# EAGLE design C128_Keyb_Test (EAGLE 9.5.2)
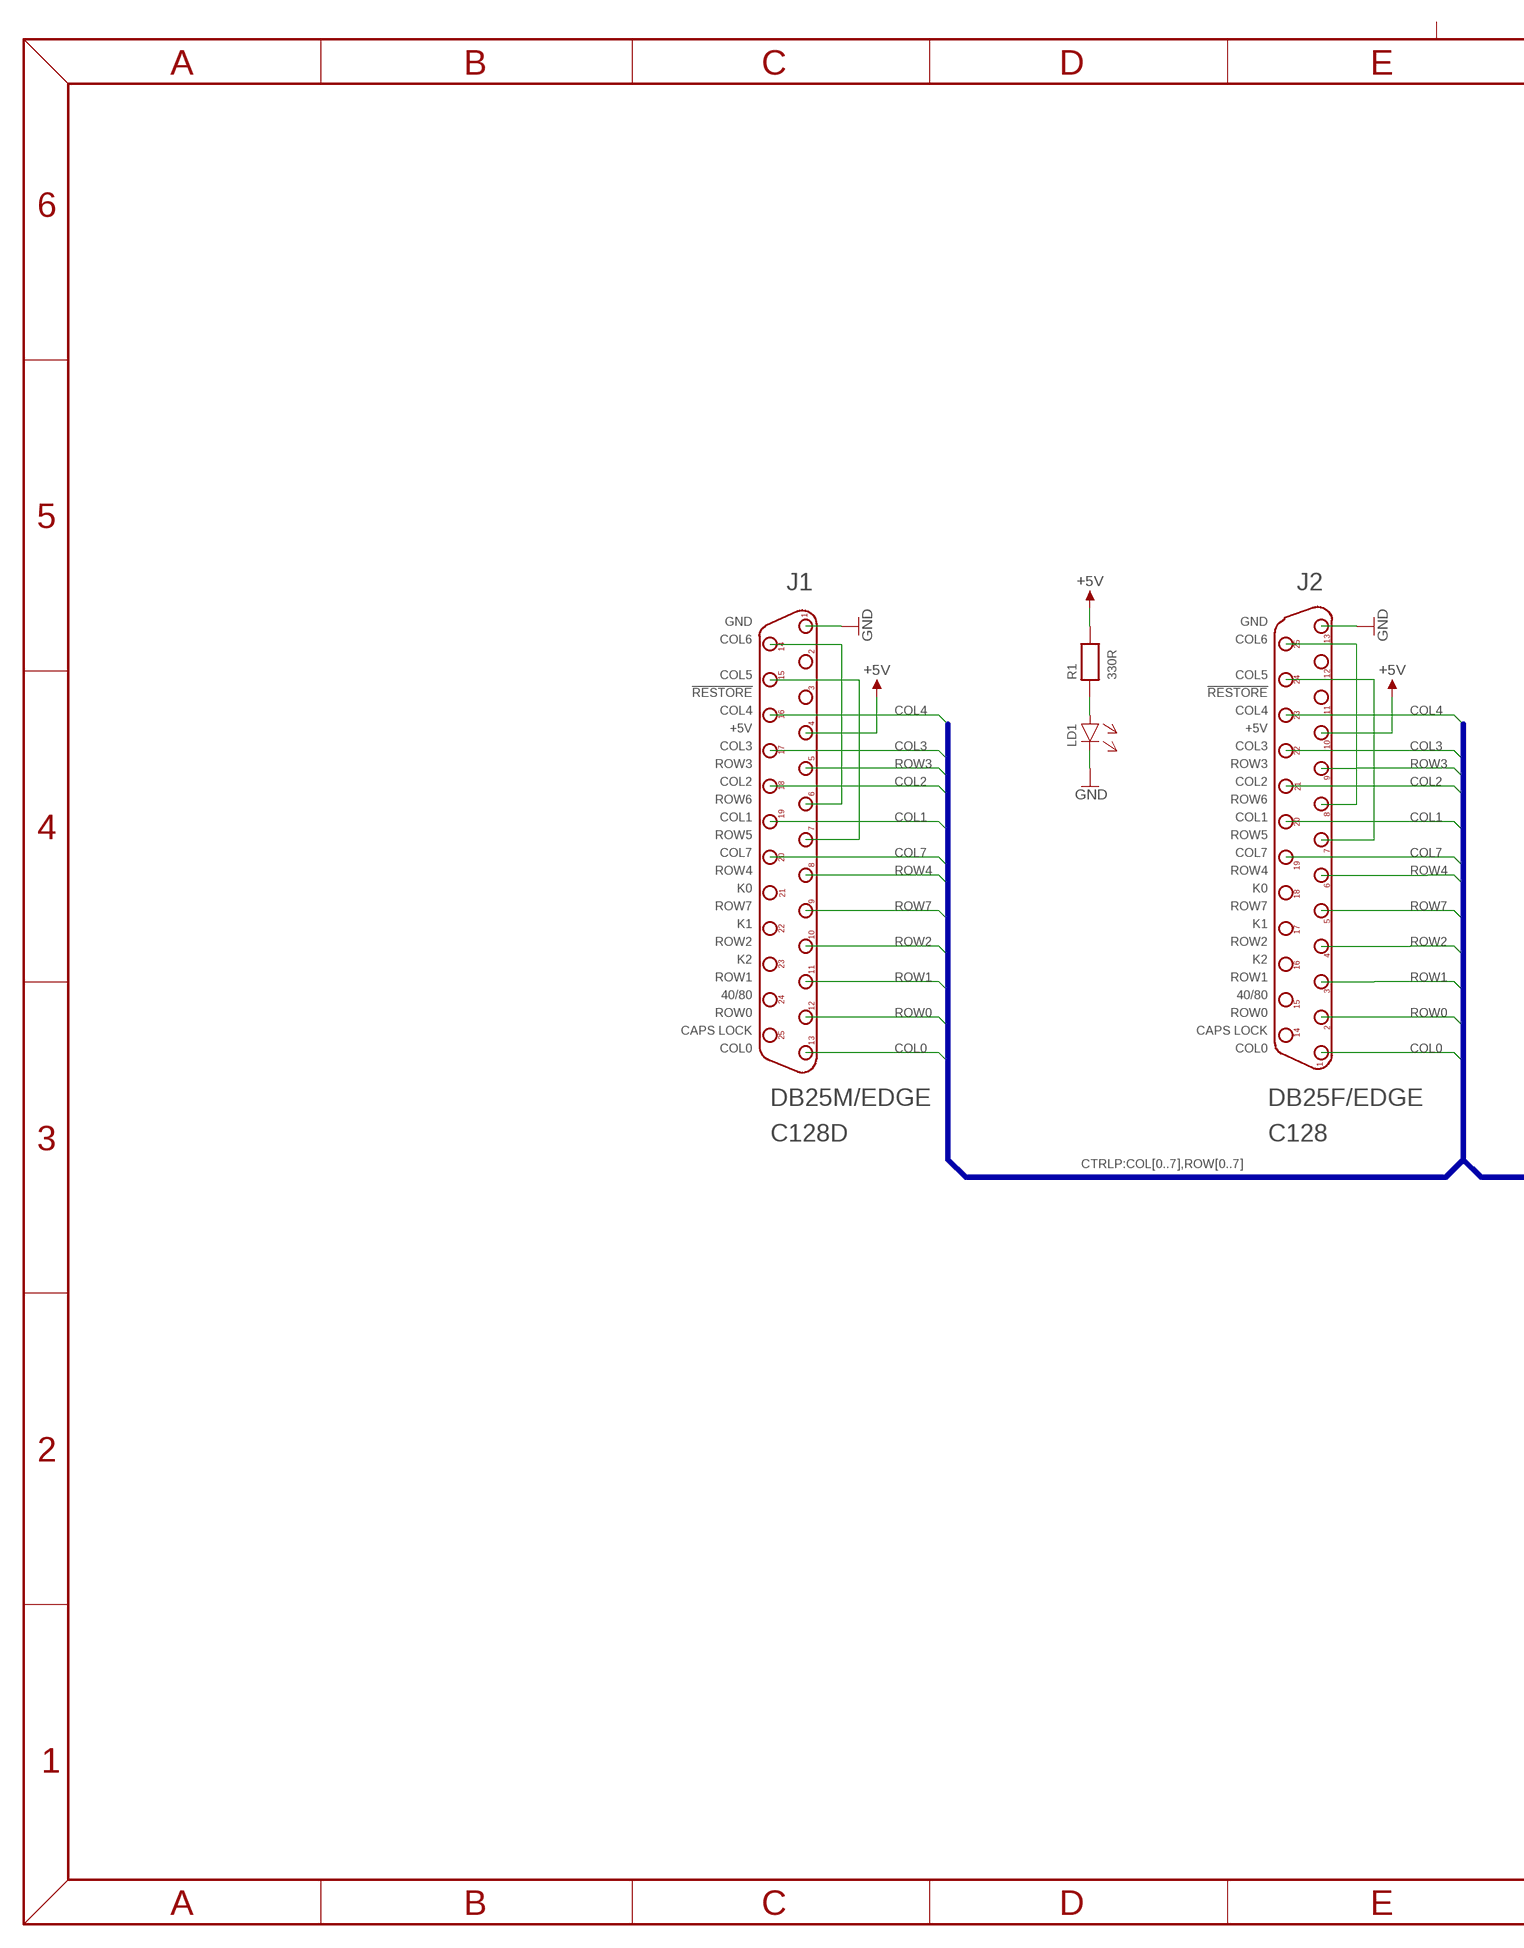
[diagram p0: schematic, sheet 1, part 1 of 2]
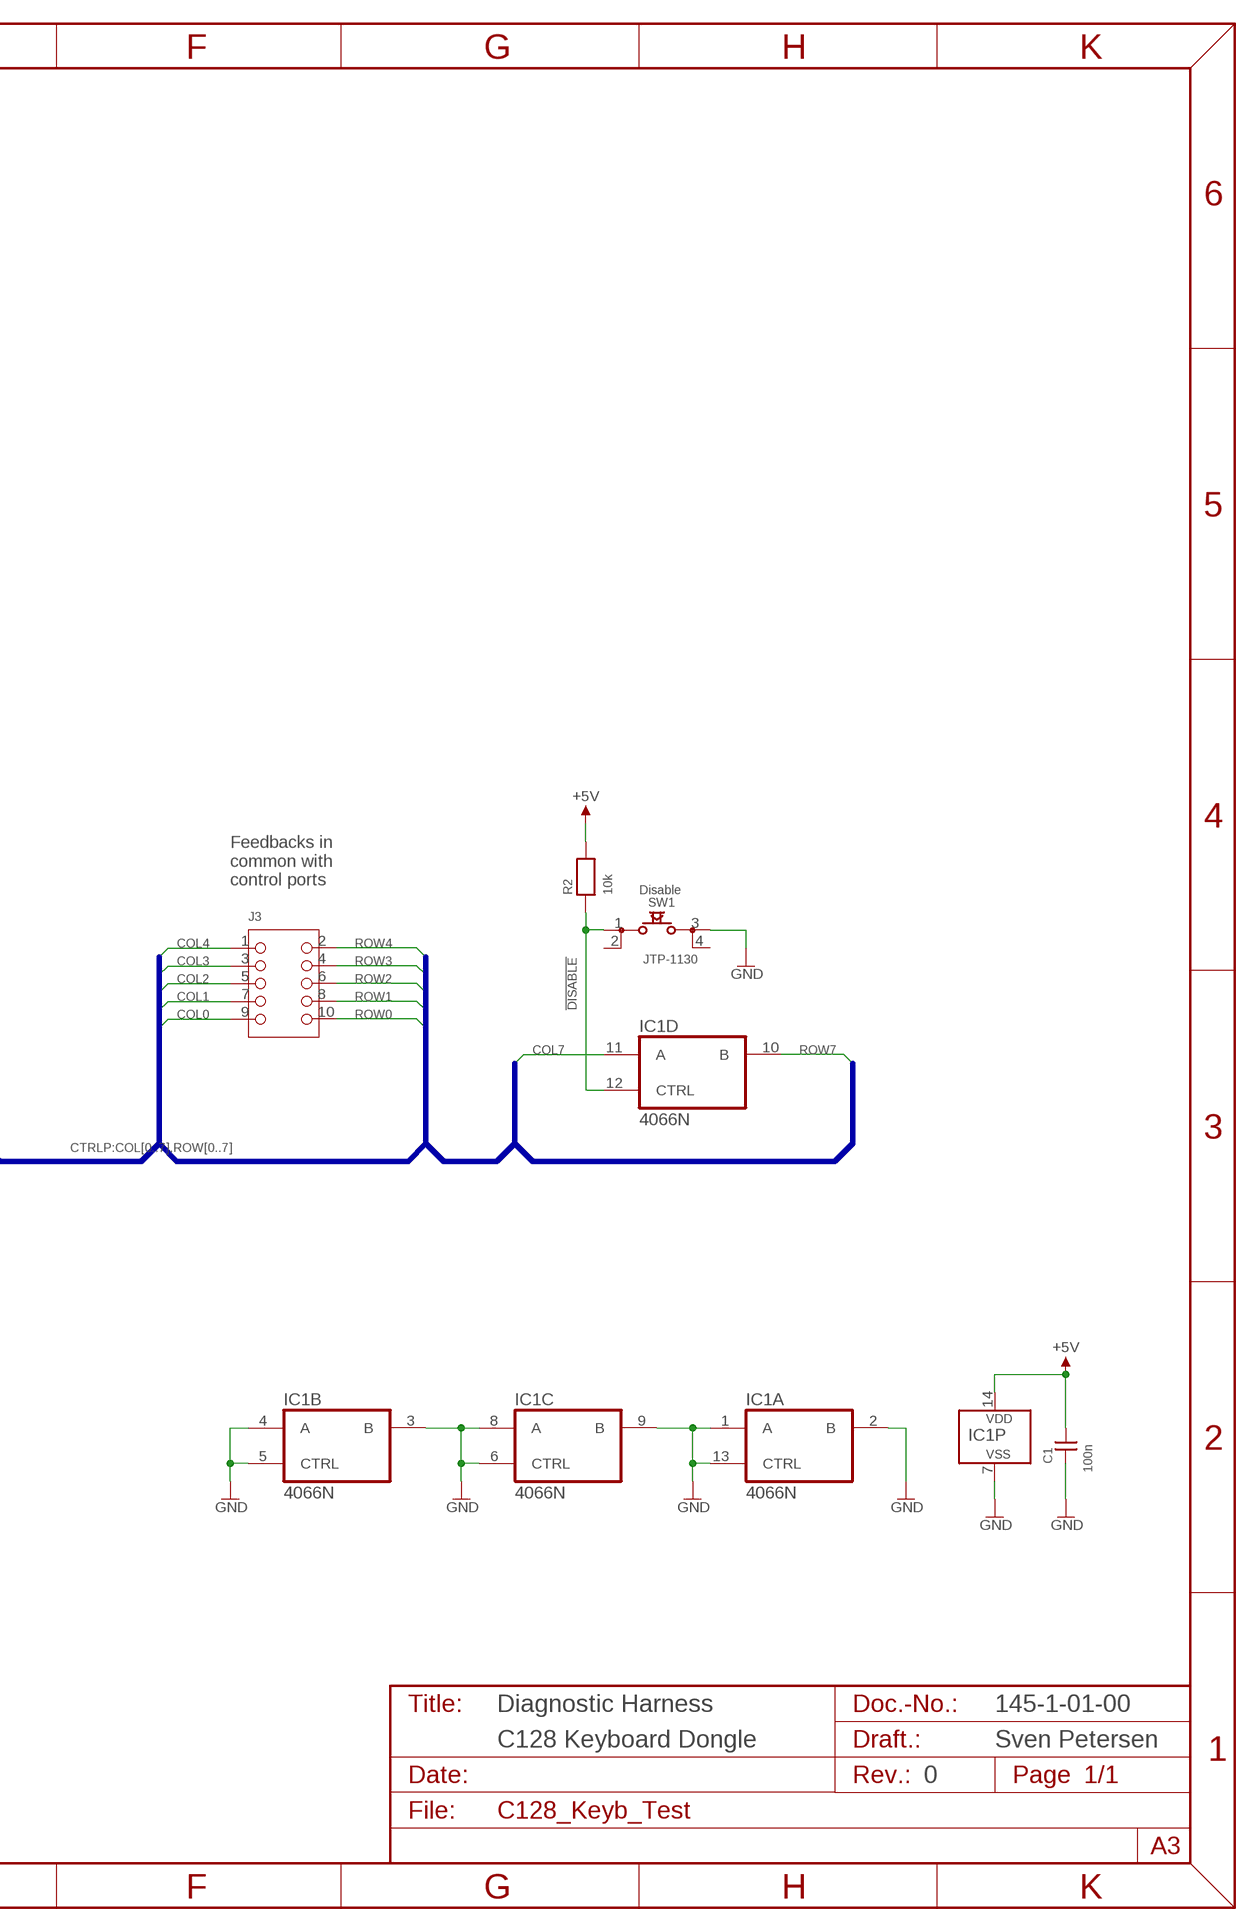
[diagram p1: schematic, sheet 1, part 2 of 2]

## Parts
C1  100n  CAP01  [C-2,5]
IC1  4066N  [DIL14]
J1  DB25M/EDGE  [DB25M-EDGE]
J2  DB25F/EDGE  [DB25F-EDGE]
J3  2X05WV  [2X05WV]
LD1  3MM  [3MM]
R1  330R  RES04  [R-10]
R2  10k  RES04  [R-10]
SW1  JTP-1130  [JTP-1130]

## Nets
!DISABLE: IC1.12(D:CTRL) R2.1 SW1.1
+5V: C1.2 IC1.14(P:VDD) J1.4 J2.10 R1.2 R2.2
COL0: J1.13 J2.1 J3.9
COL1: J1.19 J2.20 J3.7
COL2: J1.18 J2.21 J3.5
COL3: J1.17 J2.22 J3.3
COL4: J1.16 J2.23 J3.1
COL7: IC1.11(D:A) J1.20 J2.19
GND: C1.1 IC1.1(A:A) IC1.2(A:B) IC1.3(B:B) IC1.4(B:A) IC1.5(B:CTRL) IC1.6(C:CTRL) IC1.7(P:VSS) IC1.8(C:A) IC1.9(C:B) IC1.13(A:CTRL) J1.1 J2.13 LD1.C(K) SW1.3
N$1: J1.6 J1.14
N$2: J1.7 J1.15
N$3: LD1.A R1.1
N$14: J2.7 J2.24
N$15: J2.8 J2.25
ROW0: J1.12 J2.2 J3.10
ROW1: J1.11 J2.3 J3.8
ROW2: J1.10 J2.4 J3.6
ROW3: J1.5 J2.9 J3.4
ROW4: J1.8 J2.6 J3.2
ROW7: IC1.10(D:B) J1.9 J2.5
Unconnected: J1.2 J1.3 J1.21 J1.22 J1.23 J1.24 J1.25 J2.11 J2.12 J2.14 J2.15 J2.16 J2.17 J2.18 SW1.2 SW1.4

## Buses
CTRLP:COL[0..7],ROW[0..7]

## Notes on the sheet
- GND | GND
- COL6 | COL6
- COL5 | COL5
- !RESTORE | !RESTORE
- COL4 | COL4
- +5V | +5V
- COL3 | COL3
- ROW3 | ROW3
- COL2 | COL2
- ROW6 | ROW6
- COL1 | COL1
- ROW5 | ROW5
- COL7 | COL7
- ROW4 | ROW4
- K0 | K0
- Feedbacks in
  common with
  control ports
- ROW7 | ROW7 | Disable
- K1 | K1
- ROW2 | ROW2
- K2 | K2
- ROW1 | ROW1
- 40/80 | 40/80
- ROW0 | ROW0
- CAPS LOCK | CAPS LOCK
- COL0 | COL0
- C128D | C128
- Diagnostic Harness | 145-1-01-00
- C128 Keyboard Dongle | Sven Petersen
- 0

## Library data of the parts
C1 = DISCRETE:CAP01
IC1 = 40xx:4066: Quad bilateral ANALOG SWITCH
J1 = Connect:DB25M/EDGE
J2 = Connect:DB25F/EDGE
J3 = PINHEAD:2X05WV
LD1 = LED:3MM
R1 R2 = DISCRETE:RES04
SW1 = Namae_Electronics:JTP-1130

## Board
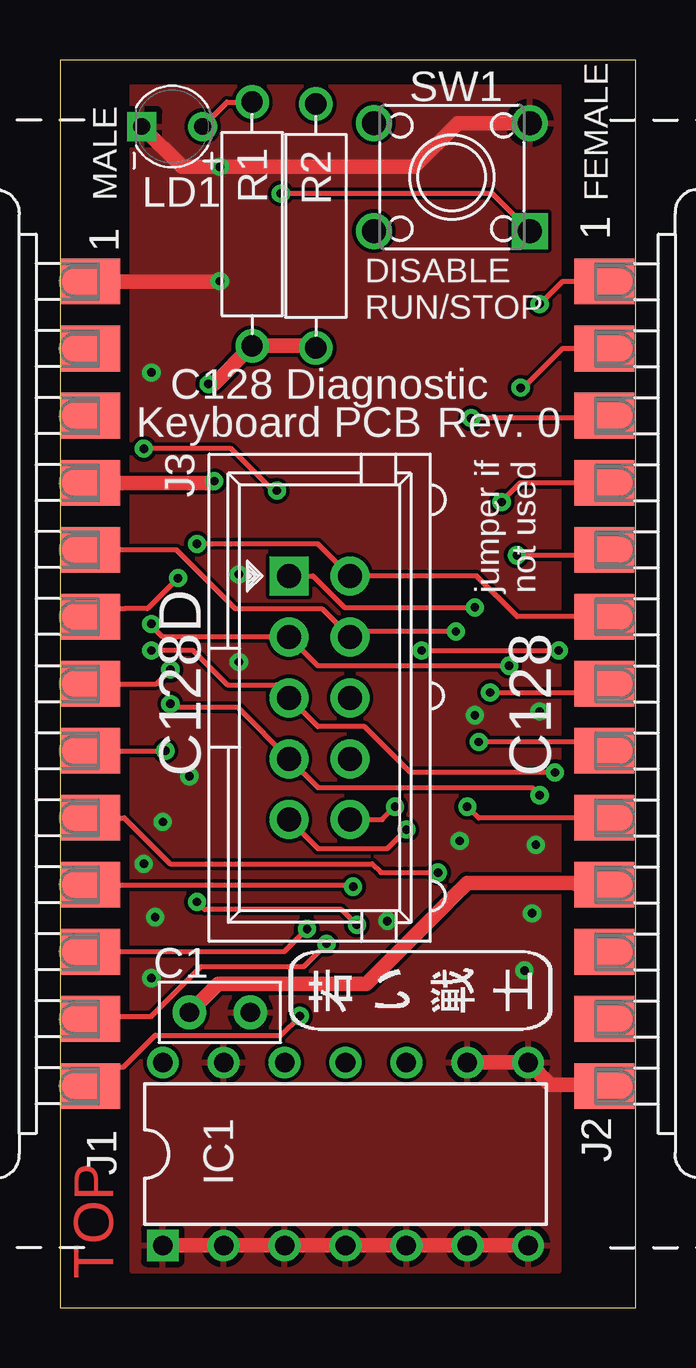
[diagram p2: board, top side]
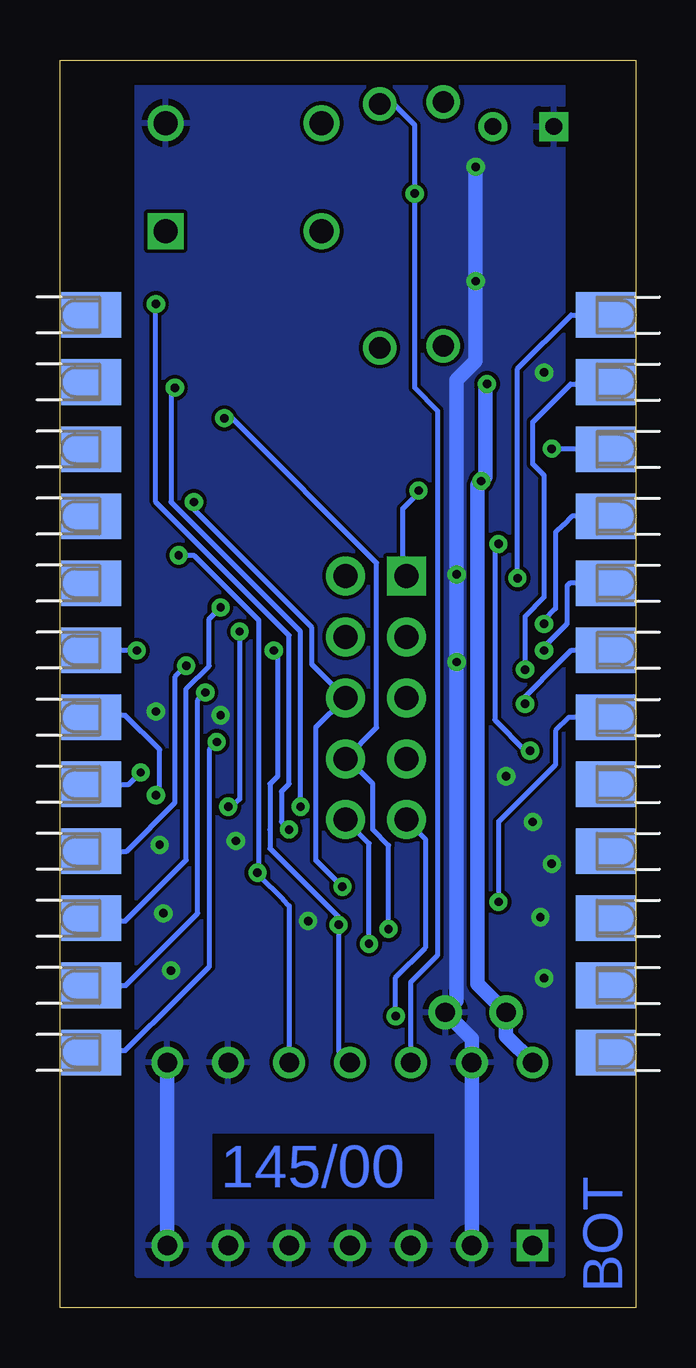
[diagram p3: board, bottom side, seen from below]

Size 24 x 52 mm. Coordinates in mm from the lower left corner, seen from the top.
Outline: 0,0 24,0 24,52 0,52 0,0
Copper layers (1*16): Top 0.035mm / dielectric 1.5mm / Bottom 0.035mm
Design rules "default *": minimum track width 6mil, minimum drill 0.35mm, track to track 6mil, track to pad 6mil, pad to pad 6mil, via to via 6mil, smd to smd 6mil, copper to edge 40mil, drill to drill 6mil, minimum pad ring 10mil, minimum via ring 8mil, stop-mask expansion 4mil, vias tented up to drill 25mil, thermal gap 10mil
bRestrict: 4 lines

### Footprints (pad centres in the part's own frame; a part is rotated, then mirrored left to right if it is on the bottom)
C-2,5 = drill 0.8 pad 1.397: 1 -1.27,0; 2 1.27,0
DIL14 = drill 0.813 square: 1 -7.62,-3.81 | drill 0.813: 2 -5.08,-3.81; 3 -2.54,-3.81; 4 0,-3.81; 5 2.54,-3.81; 6 5.08,-3.81; 7 7.62,-3.81; 8 7.62,3.81; 9 5.08,3.81; 10 2.54,3.81; 11 0,3.81; 12 -2.54,3.81; 13 -5.08,3.81; 14 -7.62,3.81
DB25M-EDGE = smd 1.9 x 2.5: 1 -16.764,1.25; 2 -13.97,1.25; 3 -11.176,1.25; 4 -8.382,1.25; 5 -5.588,1.25; 6 -2.794,1.25; 7 0,1.25; 8 2.794,1.25; 9 5.588,1.25; 10 8.382,1.25; 11 11.176,1.25; 12 13.97,1.25; 13 16.764,1.25 | smd 1.9 x 2.5 bottom: 14 -15.367,1.25; 15 -12.573,1.25; 16 -9.779,1.25; 17 -6.985,1.25; 18 -4.191,1.25; 19 -1.397,1.25; 20 1.397,1.25; 21 4.191,1.25; 22 6.985,1.25; 23 9.779,1.25; 24 12.573,1.25; 25 15.367,1.25
DB25F-EDGE = smd 1.9 x 2.5: 1 16.764,1.3; 2 13.97,1.3; 3 11.176,1.3; 4 8.382,1.3; 5 5.588,1.3; 6 2.794,1.3; 7 0,1.3; 8 -2.794,1.3; 9 -5.588,1.3; 10 -8.382,1.3; 11 -11.176,1.3; 12 -13.97,1.3; 13 -16.764,1.3 | smd 1.9 x 2.5 bottom: 14 15.367,1.3; 15 12.573,1.3; 16 9.779,1.3; 17 6.985,1.3; 18 4.191,1.3; 19 1.397,1.3; 20 -1.397,1.3; 21 -4.191,1.3; 22 -6.985,1.3; 23 -9.779,1.3; 24 -12.573,1.3; 25 -15.367,1.3
2X05WV = drill 1 pad 1.626 square: 1 -5.08,-1.27 | drill 1 pad 1.626: 2 -5.08,1.27; 3 -2.54,-1.27; 4 -2.54,1.27; 5 0,-1.27; 6 0,1.27; 7 2.54,-1.27; 8 2.54,1.27; 9 5.08,-1.27; 10 5.08,1.27
3MM = drill 0.7: A -1.27,0 | drill 0.7 square: C 1.27,0
R-10 = drill 0.889 pad 1.397: 1 -5.08,0; 2 5.08,0
JTP-1130 = drill 1 square: 1 3.25,-2.25 | drill 1: 2 -3.25,-2.25; 3 3.25,2.25; 4 -3.25,2.25

### Placement (x,y rotation side)
C1  6.67,12.3 180 top
IC1  11.91,6.4 0 top
J1  0,26 270 top
J2  24,26 90 top
J3  10.82,25.41 270 top
LD1  4.68,49.23 180 top
R1  8.01,45.16 270 top
R2  10.67,45.08 270 top
SW1  16.34,47.12 0 top
U$8  [2LAYER]  2.22,1.19 90 top
U$9  [PCB-TITLE/]  0,58.18 0 top  (outside the outline)
U$10  [SVEN_TAG]  14.92,13.26 90 top

### Tracks (layer width: path | path; a pad name or v marks a point on that pad's centre or on a via)
!DISABLE  (via drill 0.35)
  Top 0.203: SW1.1 18.02,46.43 v9.21,46.43
  Bottom 0.203: IC1.12 9.37,13.57 8.26,14.68 8.26,37.38 9.21,38.34 v9.21,46.43 9.21,49.29 10.08,50.16 R2.1
+5V  (via drill 0.35)
  Top 0.203: J2.10 21.57,17.62 | J1.4 2.05,34.38 2.06,34.37
  Top 0.61: 6.36,34.38 v6.43,34.45 6.35,34.37 2.06,34.37 | v6.19,38.5 6.43,38.5 R1.2 10.59,40.08 R2.2 | C1.2 6.58,13.49 11.35,13.49 12.78,13.49 16.03,16.75 16.35,17.06 16.99,17.7 21.49,17.7 21.57,17.62
  Bottom 0.61: v6.19,38.5 6.27,38.42 6.27,34.61 v6.43,34.45 6.59,34.29 6.59,13.49 C1.2 5.4,11.32 IC1.14
COL0  (via drill 0.35)
  Top 0.152: 2.59,10.03 2.65,10.03
  Top 0.203: 2.59,10.03 2.04,10.03 J1.13 | J3.9 10.76,19.13 13.65,19.13 v14.45,19.92 | J2.1 20.95,42.76 20.02,41.83 v20,41.83 | v10,12.14 9.21,11.35 3.97,11.35 2.65,10.03
  Bottom 0.203: J3.9 8.76,19.54 8.76,15 10,13.76 v10,12.14 | v14.45,19.92 14.76,20.24 14.76,21.51 14.45,21.83 14.45,28.02 20,33.58 v20,41.83
COL1  (via drill 0.35)
  Top 0.203: v4.6,25.16 4.76,25 7.43,25 J3.7 10.76,21.67 19.68,21.67 v20,21.35
  Bottom 0.203: J1.19 1.26,27.38 2.7,27.38 3.17,26.91 4.6,25.48 v4.6,25.16 | J2.20 22.62,24.68 21.27,24.68 19.84,23.26 19.84,21.51 v20,21.35
COL2  (via drill 0.35)
  Top 0.203: v20.64,22.3 14.61,22.3 12.7,24.21 10.76,24.21 J3.5 9.01,25.95 6.99,25.95 5.56,27.38 v3.81,27.38
  Bottom 0.203: J2.21 21.13,21.81 v20.64,22.3 | J1.18 2.75,30.19 2.86,30.08 2.86,28.5 3.81,27.54 v3.81,27.38
COL3  (via drill 0.35)
  Top 0.203: v18.73,26.75 10.76,26.75 J3.3 4.29,27.95 3.81,28.43 v3.81,28.5
  Bottom 0.203: J2.22 21.23,19.02 19.21,21.03 19.21,26.27 v18.73,26.75 | J1.17 2.65,32.98 3.02,32.62 3.33,32.3 3.33,31.83 3.33,29.13 3.81,28.65 v3.81,28.5
COL4  (via drill 0.35)
  Top 0.203: v9.05,34.05 8.89,34.05 7.14,35.8 v3.49,35.8 | J3.1 10.54,30.49 11.11,29.92 11.86,29.18 v17.3,29.18
  Bottom 0.203: v9.05,34.05 9.05,33.95 9.71,33.29 9.71,30.65 J3.1 | v3.49,35.8 1.27,35.8 J1.16 | J2.23 22.59,16.11 21.27,16.11 18.73,18.65 18.73,25.8 17.78,26.75 17.78,28.7 v17.3,29.18
COL7  (via drill 0.35)
  Top 0.203: v12.38,15.95 11.75,16.59 6.03,16.59 v5.71,16.91 | v15.08,27.38 v20.8,27.38
  Bottom 0.203: J1.20 2.78,24.6 3.33,24.05 3.33,22.62 5.71,20.24 v5.71,16.91 | IC1.11 12.38,10.68 v12.38,15.95 12.38,16.27 15.24,19.13 15.24,19.92 15.24,21.83 14.92,22.14 14.92,27.23 v15.08,27.38 | v20.8,27.38 22.69,27.38 J2.19
GND  (via drill 0.35)
  Top 0.203: 21.59,9.29 22.65,9.29 J2.13
  Top 0.61: IC1.1 IC1.2 IC1.3 IC1.4 IC1.5 IC1.6 IC1.7 | IC1.9 IC1.8 20.45,9.29 21.59,9.29 | J1.1 6.65,42.76 v6.67,42.78 | SW1.3 16.59,49.37 14.76,47.55 v6.67,47.55 5.09,47.55 LD1.C
  Bottom 0.61: IC1.7 IC1.8 | IC1.2 IC1.13 6.83,11.19 C1.1 7.46,12.78 7.46,38.66 6.67,39.45 v6.67,42.78 v6.67,47.55
  other vias: 4.29,20.24 5.4,22.14 3.81,38.97 19.37,14.05 19.68,16.43 16.67,19.45 20,24.84 19.84,19.29 17.3,24.68 7.46,30.56 7.46,26.91 3.97,16.27 3.81,13.73 3.49,18.49 13.65,16.11
  pour Top: 3.02,51.12 20.8,51.12 20.8,1.51 3.02,1.51
  pour Bottom: 3.02,51.12 20.8,51.12 20.8,1.35 3.02,1.35
N$1  (via drill 0.35)
  Top 0.203: J1.6 1.59,29.13 2.7,29.13 3.65,29.13 4.76,30.24 v4.92,30.4
  Bottom 0.203: v4.92,30.4 4.92,39.13 2.69,41.37 J1.14
N$2  (via drill 0.35)
  Top 0.203: v4.6,26.59 4.01,26 J1.7
  Bottom 0.203: J1.15 1.33,38.5 2.7,38.5 4.29,36.91 4.29,35.16 3.81,34.69 3.81,29.61 4.6,28.81 v4.6,26.59
N$3
  Top 0.203: LD1.A 6.97,50.24 R1.1
N$14  (via drill 0.35)
  Top 0.203: v17.94,25.64 22.34,25.64 J2.7
  Bottom 0.203: J2.24 21.26,13.43 18.26,16.43 18.26,25.32 v17.94,25.64
N$15  (via drill 0.35)
  Top 0.203: v17.46,23.57 22.33,23.57 J2.8
  Bottom 0.203: J2.25 22.62,10.71 21.27,10.71 19.05,12.94 17.78,14.21 17.78,23.26 v17.46,23.57
ROW0  (via drill 0.35)
  Top 0.203: J1.12 1.36,12.14 3.81,12.14 5.87,14.21 10.16,14.21 v11.11,15.16 | J3.10 13.43,20.33 v13.97,20.88 | J2.2 20.95,39.97 19.32,38.34 v19.21,38.34
  Bottom 0.203: v11.11,15.16 11.11,19.35 J3.10 | v13.97,20.88 13.97,26.43 13.97,28.18 19.37,33.58 19.37,38.18 v19.21,38.34
ROW1  (via drill 0.35)
  Top 0.203: v10.3,15.78 9.35,14.82 J1.11 | J2.3 22.59,37.07 v17.14,37.07
  Bottom 0.203: v10.3,15.78 10.3,19.27 10.95,19.92 10.95,21.83 12,22.87 J3.8 10.79,24.17 10.79,31.04 16.83,37.07 v17.14,37.07
ROW2  (via drill 0.35)
  Top 0.203: J1.10 12.15,17.62 v12.22,17.54 | v18.41,33.58 18.41,33.59 19.21,34.38 J2.4
  Bottom 0.203: v18.41,33.58 18.41,33.26 13.49,28.34 13.49,26.81 J3.6 13.34,24.17 13.34,18.65 v12.22,17.54
ROW3  (via drill 0.35)
  Top 0.203: J1.5 4.84,31.59 7.3,29.13 10.92,29.13 J3.4 12.32,28.18 v16.51,28.18 | v16.99,20.88 17.46,20.4 22.69,20.4 J2.9
  Bottom 0.203: v16.51,28.18 16.51,21.19 16.83,20.88 v16.99,20.88
ROW4  (via drill 0.35)
  Top 0.203: J2.6 19.07,28.79 17.37,30.49 J3.2 10.76,31.83 v5.71,31.83 | J1.8 v4.39,23.21
  Bottom 0.203: v5.71,31.83 5.87,31.67 5.87,24.49 4.59,23.21 v4.39,23.21
ROW7  (via drill 0.35)
  Top 0.203: J1.9 2.69,20.41 4.6,18.49 13.02,18.49 13.38,18.13 v15.77,18.13 | J2.5 22.46,31.35 v19.05,31.35
  Bottom 0.203: IC1.10 14.45,16.75 14.68,16.99 15.72,18.02 15.72,18.18 | 15.72,18.18 v15.77,18.13 | 15.72,18.18 15.72,28.65 18.41,31.35 v19.05,31.35

### Text on the board
Bottom: 145/00
tPlace: MALE | FEMALE | DISABLE / RUN/STOP | C128 Diagnostic | Keyboard PCB | Rev. 0 | jumper if / not used | C128D | C128
Document: 145-2-01-00 | Sven Petersen / 2020 | 35µ | 2 | 0